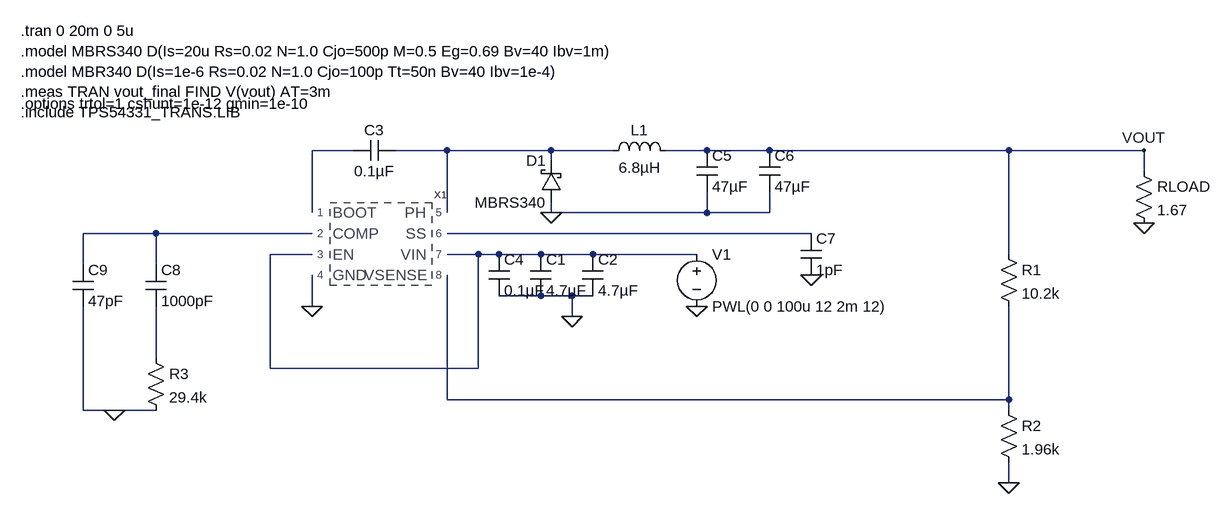
[diagram p0: schematic TPS54331_5V_3A_Buck.asc]
TPS54331_5V_3A_Buck.asc, the LTspice schematic file:
Version 4
SHEET 1 2000 880
WIRE 688 240 624 240
WIRE 832 240 752 240
WIRE 992 240 832 240
WIRE 1088 240 992 240
WIRE 1232 240 1168 240
WIRE 1328 240 1232 240
WIRE 1696 240 1328 240
WIRE 1904 240 1696 240
WIRE 992 256 992 240
WIRE 1904 272 1904 240
WIRE 624 336 624 240
WIRE 832 336 832 240
WIRE 992 336 992 320
WIRE 1232 336 1232 304
WIRE 1232 336 992 336
WIRE 1328 336 1328 304
WIRE 1328 336 1232 336
WIRE 384 368 272 368
WIRE 624 368 384 368
WIRE 1392 368 832 368
WIRE 624 400 560 400
WIRE 880 400 832 400
WIRE 912 400 880 400
WIRE 976 400 912 400
WIRE 1056 400 976 400
WIRE 1216 400 1056 400
WIRE 1696 400 1696 240
WIRE 272 416 272 368
WIRE 384 416 384 368
WIRE 976 464 912 464
WIRE 1024 464 976 464
WIRE 1056 464 1024 464
WIRE 624 480 624 432
WIRE 1024 496 1024 464
WIRE 384 560 384 480
WIRE 560 576 560 400
WIRE 880 576 880 400
WIRE 880 576 560 576
WIRE 832 624 832 432
WIRE 1696 624 1696 480
WIRE 1696 624 832 624
WIRE 272 640 272 480
WIRE 320 640 272 640
WIRE 384 640 320 640
WIRE 1696 640 1696 624
WIRE 1696 752 1696 720
FLAG 1216 480 0
FLAG 1024 496 0
FLAG 624 480 0
FLAG 1696 752 0
FLAG 1392 432 0
FLAG 320 640 0
FLAG 1904 352 0
FLAG 1904 240 VOUT
FLAG 992 336 0
SYMBOL voltage 1216 384 R0
SYMATTR InstName V1
SYMATTR Value PWL(0 0 100u 12 2m 12)
SYMBOL TPS54331_TRANS 656 464 R0
SYMATTR InstName X1
SYMATTR Prefix X
SYMATTR Value TPS54331_TRANS
SYMBOL cap 960 400 R0
SYMATTR InstName C1
SYMATTR Value 4.7µF
SYMBOL cap 1040 400 R0
SYMATTR InstName C2
SYMATTR Value 4.7µF
SYMBOL Cap 896 400 R0
SYMATTR InstName C4
SYMATTR Value 0.1µF
SYMBOL ind 1072 256 R270
WINDOW 0 32 56 VTop 2
WINDOW 3 5 56 VBottom 2
SYMATTR InstName L1
SYMATTR Value 6.8µH
SYMBOL schottky 1008 320 R180
WINDOW 0 24 64 Left 2
WINDOW 3 24 0 Left 2
SYMATTR InstName D1
SYMATTR Value MBRS340
SYMBOL Cap 752 224 R90
WINDOW 0 0 32 VBottom 2
WINDOW 3 32 32 VTop 2
SYMATTR InstName C3
SYMATTR Value 0.1µF
SYMBOL Cap 1216 240 R0
SYMATTR InstName C5
SYMATTR Value 47µF
SYMBOL Cap 1312 240 R0
SYMATTR InstName C6
SYMATTR Value 47µF
SYMBOL Res 1680 384 R0
SYMATTR InstName R1
SYMATTR Value 10.2k
SYMBOL Res 1680 624 R0
SYMATTR InstName R2
SYMATTR Value 1.96k
SYMBOL Cap 1376 368 R0
SYMATTR InstName C7
SYMATTR Value 1pF
SYMBOL Cap 368 416 R0
SYMATTR InstName C8
SYMATTR Value 1000pF
SYMBOL Res 368 544 R0
SYMATTR InstName R3
SYMATTR Value 29.4k
SYMBOL Res 1888 256 R0
SYMATTR InstName RLOAD
SYMATTR Value 1.67
SYMBOL Cap 256 416 R0
SYMATTR InstName C9
SYMATTR Value 47pF
TEXT 176 56 Left 2 !.tran 0 20m 0 5u\n.model MBRS340 D(Is=20u Rs=0.02 N=1.0 Cjo=500p M=0.5 Eg=0.69 Bv=40 Ibv=1m)\n.model MBR340 D(Is=1e-6 Rs=0.02 N=1.0 Cjo=100p Tt=50n Bv=40 Ibv=1e-4)\n.meas TRAN vout_final FIND V(vout) AT=3m\n.include TPS54331_TRANS.LIB
TEXT 176 168 Left 2 !.options trtol=1 cshunt=1e-12 gmin=1e-10

The netlist it stands for:
* TPS54331_5V_3A_Buck.asc
V1 N005 0 PWL(0 0 100u 12 2m 12)
XX1 N001 N003 N005 0 N002 N004 N005 N007 TPS54331_TRANS params: TPS54331_TRANS  ; pins 1 2 3 4 5 6 7 8
C1 N005 0 4.7µF
C2 N005 0 4.7µF
C4 N005 0 0.1µF
L1 N002 VOUT 6.8µH
D1 0 N002 MBRS340
C3 N002 N001 0.1µF
C5 VOUT 0 47µF
C6 VOUT 0 47µF
R1 VOUT N007 10.2k
R2 N007 0 1.96k
C7 N004 0 1pF
C8 N003 N006 1000pF
R3 N006 0 29.4k
RLOAD VOUT 0 1.67
C9 N003 0 47pF
.model D D
.lib standard.dio
.tran 0 20m 0 5u
.model MBRS340 D(Is=20u Rs=0.02 N=1.0 Cjo=500p M=0.5 Eg=0.69 Bv=40 Ibv=1m)
.model MBR340 D(Is=1e-6 Rs=0.02 N=1.0 Cjo=100p Tt=50n Bv=40 Ibv=1e-4)
.meas TRAN vout_final FIND V(vout) AT=3m
.include TPS54331_TRANS.LIB
.options trtol=1 cshunt=1e-12 gmin=1e-10
.backanno
.end